# EAGLE schematic v.0.0.0 (EAGLE 5.11)

## Sheet 1 of 7
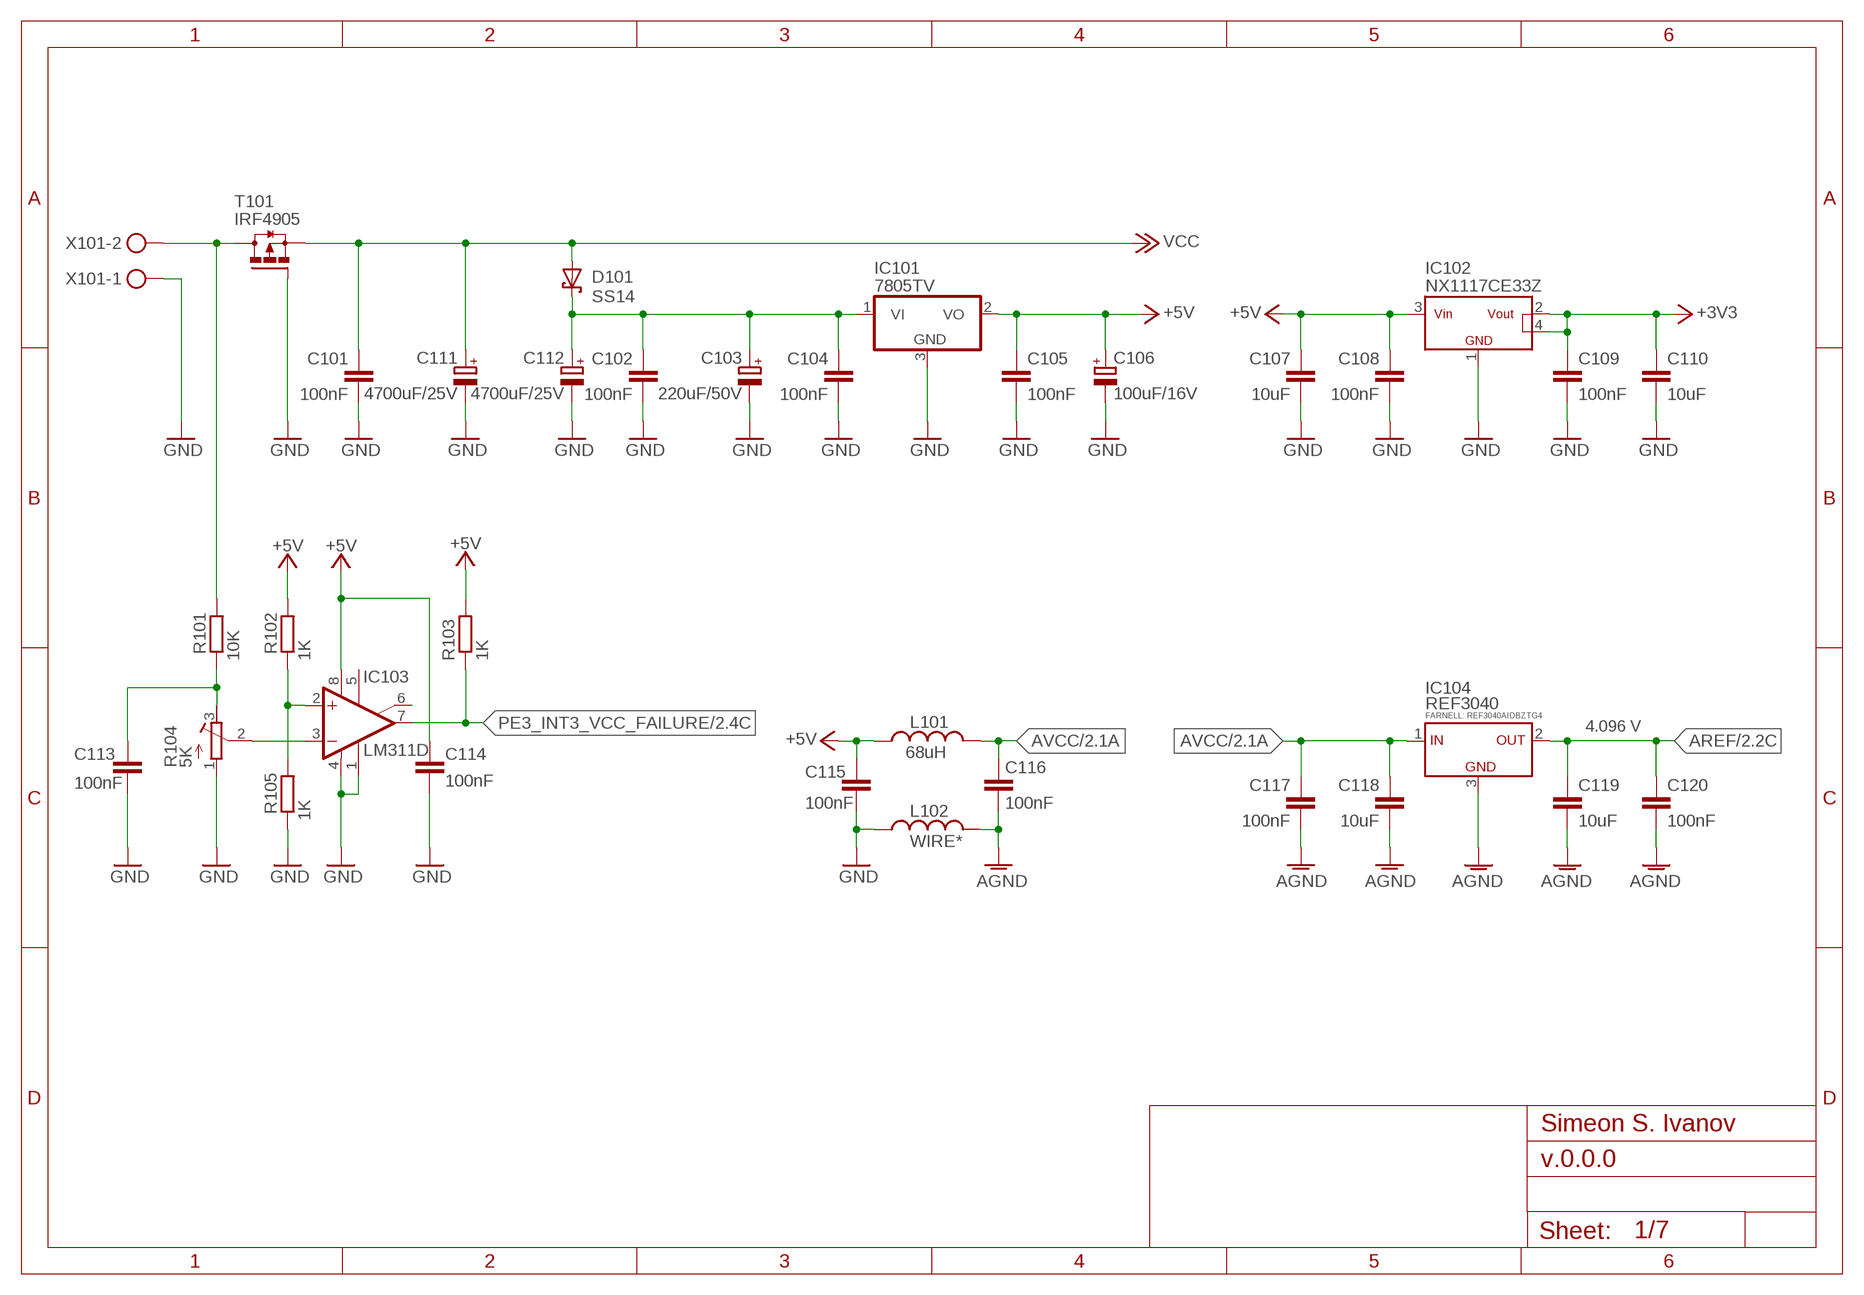
[diagram p0: schematic, sheet 1]

### Parts
C101  100nF  C-EUC1206  [C1206]
C102  100nF  C-EUC1206  [C1206]
C103  220uF/50V  CPOL-EU153CLV-0605  [153CLV-0605]
C104  100nF  C-EUC1206  [C1206]
C105  100nF  C-EUC1206  [C1206]
C106  100uF/16V  CPOL-EU153CLV-0605  [153CLV-0605]
C107  10uF  C-EUC0805  [C0805]
C108  100nF  C-EUC0603  [C0603]
C109  100nF  C-EUC0603  [C0603]
C110  10uF  C-EUC0805  [C0805]
C111  4700uF/25V  CPOL-EU_Ø500  [CP300X100X24]
C112  4700uF/25V  CPOL-EU_Ø500  [CP300X100X24]
C113  100nF  C-EUC1206  [C1206]
C114  100nF  C-EUC1206  [C1206]
C115  100nF  C-EUC1206  [C1206]
C116  100nF  C-EUC1206  [C1206]
C117  100nF  C-EUC0603  [C0603]
C118  10uF  C-EUC0805  [C0805]
C119  10uF  C-EUC0805  [C0805]
C120  100nF  C-EUC0603  [C0603]
D101  SS14  1N581SMD  [DO214AC]
IC101  7805TV  7805DT  [TO252]
IC102  NX1117CE33Z  LM317_SOT223  [SOT223]
IC103  LM311D  [SO08]
IC104  REF3040  REF33XX  [SOT23]
L101  68uH  L-US0207/2V  [0207/2V@1]
L102  WIRE*  L-US0207/2V  [0207/2V@1]
R101  10K  R-EU_R1206  [R1206]
R102  1K  R-EU_R1206  [R1206]
R103  1K  R-EU_R1206  [R1206]
R104  5K  R-TRIMM64W  [RTRIM64W]
R105  1K  R-EU_R1206  [R1206]
T101  IRF4905  PMOSFET_PTO220  [TO220]
X101  AK500/21  [AWG/2-H]

### Nets
+3V3: C109.1 C110.1 IC102.2 IC102.4(TAB) ; also sheet 6
+5V: C105.1 C106.+ C107.1 C108.1 C114.2 C115.1 IC101.2(VO) IC102.3 IC103.8(V+) L101.1 R102.2 R103.2 ; also sheet 2,4,5,7
AGND: C116.2 C117.2 C118.2 C119.2 C120.2 IC104.3 L102.2 ; also sheet 2
AREF: C119.1 C120.1 IC104.2 ; also sheet 2
AVCC: C116.1 C117.1 C118.1 IC104.1 L101.2 ; also sheet 2
GND: C101.2 C102.2 C103.- C104.2 C105.2 C106.- C107.2 C108.2 C109.2 C110.2 C111.-(-1) C112.-(-1) C113.2 C114.1 C115.2 IC101.3(GND) IC102.1 IC103.1(GND) IC103.4(V-) L102.1 R104.1(E) R105.1 T101.1(G) X101.1 ; also sheet 2,3,4,5,6,7
N$2: R101.2 T101.2(D) X101.2
N$44: C102.1 C103.+ C104.1 C112.+(+1) D101.C IC101.1(VI)
N$66: IC103.3(-IN) R104.2(S)
N$72: C113.1 R101.1 R104.3(A)
N$81: IC103.2(+IN) R102.1 R105.2
PE3_INT3_VCC_FAILURE: IC103.7(OUT) R103.1 ; also sheet 2
VCC: C101.1 C111.+(+1) D101.A T101.3(S) ; also sheet 3
Unconnected: IC103.5(ON) IC103.6(ON/STR)

### Notes on the sheet
- FARNELL: REF3040AIDBZTG4
- 4.096 V
- Simeon S. Ivanov

## Sheet 2 of 7
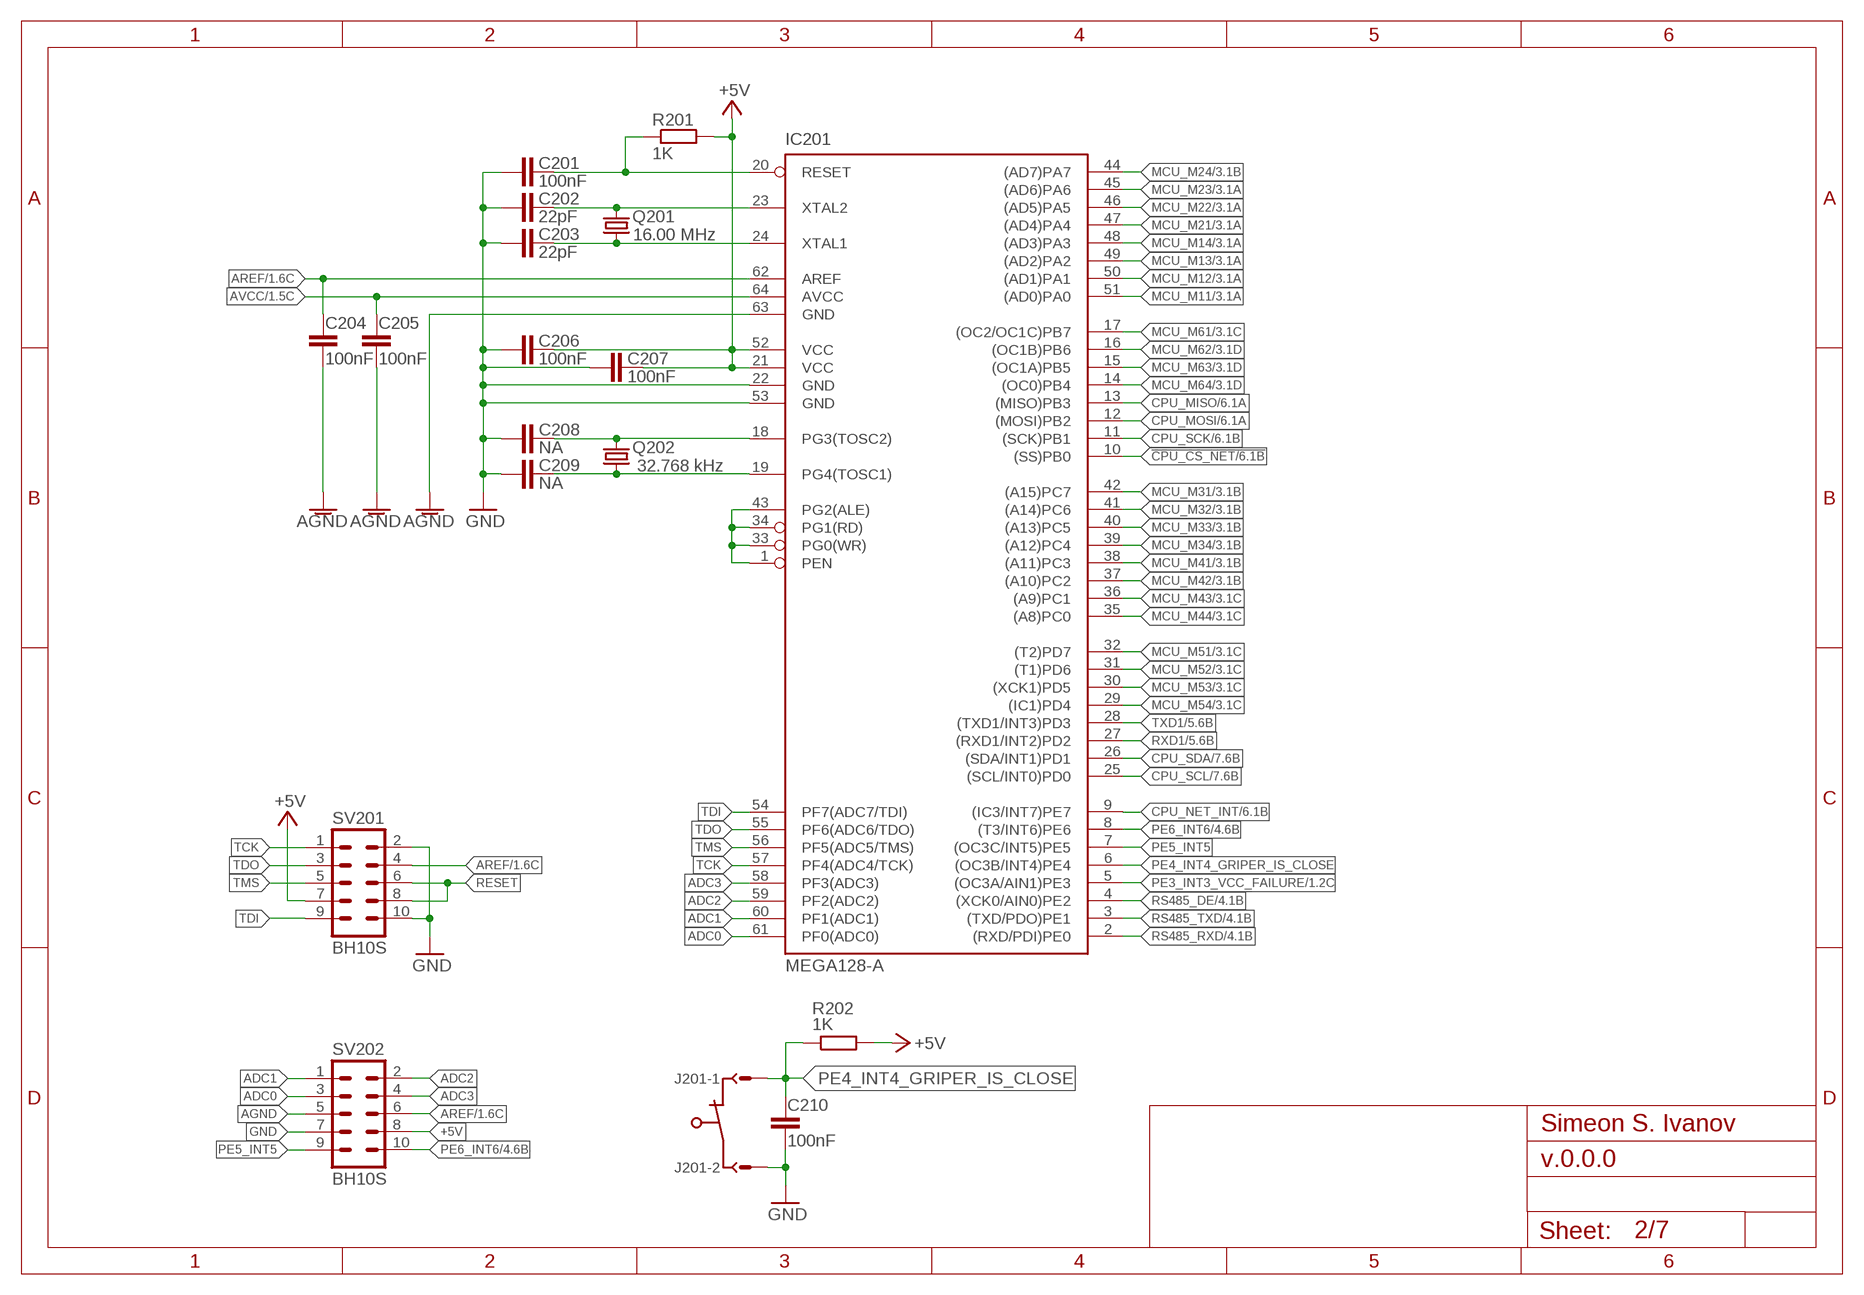
[diagram p1: schematic, sheet 2]

### Parts
C201  100nF  C-EUC1206  [C1206]
C202  22pF  C-EUC0805  [C0805]
C203  22pF  C-EUC0805  [C0805]
C204  100nF  C-EUC0603  [C0603]
C205  100nF  C-EUC0603  [C0603]
C206  100nF  C-EUC0805  [C0805]
C207  100nF  C-EUC0603  [C0603]
C208  NA  C-EUC0603  [C0603]
C209  NA  C-EUC0603  [C0603]
C210  100nF  C-EUC1206  [C1206]
IC201  MEGA128-A  MEGA128TQFP64-HOME  [TQFP64-HOME]
J201  22-27-2021-02  [6410-02]
Q201  16.00 MHz  CRYSTALHC49/S-HOME  [HC49/S-HOME]
Q202  32.768 kHz  CRYSTALTC38H  [TC38H]
R201  1K  R-EU_R1206  [R1206]
R202  1K  R-EU_R1206  [R1206]
SV201  BH10S  ML10M10-HOME  [M10-HOME]
SV202  BH10S  ML10M10-HOME  [M10-HOME]

### Nets
!CPU_CS_NET: IC201.10((SS)PB0) ; also sheet 6
+5V: C206.2 C207.2 IC201.21(VCC) IC201.52(VCC) R201.2 R202.2 SV201.7 SV202.8 ; also sheet 1,4,5,7
ADC0: IC201.61(PF0(ADC0)) SV202.3
ADC1: IC201.60(PF1(ADC1)) SV202.1
ADC2: IC201.59(PF2(ADC2)) SV202.2
ADC3: IC201.58(PF3(ADC3)) SV202.4
AGND: C204.1 C205.1 IC201.63(GND) SV202.5 ; also sheet 1
AREF: C204.2 IC201.62(AREF) SV201.4 SV202.6 ; also sheet 1
AVCC: C205.2 IC201.64(AVCC) ; also sheet 1
CPU_MISO: IC201.13((MISO)PB3) ; also sheet 6
CPU_MOSI: IC201.12((MOSI)PB2) ; also sheet 6
CPU_NET_INT: IC201.9((IC3/INT7)PE7) ; also sheet 6
CPU_SCK: IC201.11((SCK)PB1) ; also sheet 6
CPU_SCL: IC201.25((SCL/INT0)PD0) ; also sheet 7
CPU_SDA: IC201.26((SDA/INT1)PD1) ; also sheet 7
GND: C201.1 C202.1 C203.1 C206.1 C207.1 C208.1 C209.1 C210.1 IC201.22(GND) IC201.53(GND) J201.2 SV201.2 SV201.10 SV202.7 ; also sheet 1,3,4,5,6,7
MCU_M11: IC201.51((AD0)PA0) ; also sheet 3
MCU_M12: IC201.50((AD1)PA1) ; also sheet 3
MCU_M13: IC201.49((AD2)PA2) ; also sheet 3
MCU_M14: IC201.48((AD3)PA3) ; also sheet 3
MCU_M21: IC201.47((AD4)PA4) ; also sheet 3
MCU_M22: IC201.46((AD5)PA5) ; also sheet 3
MCU_M23: IC201.45((AD6)PA6) ; also sheet 3
MCU_M24: IC201.44((AD7)PA7) ; also sheet 3
MCU_M31: IC201.42((A15)PC7) ; also sheet 3
MCU_M32: IC201.41((A14)PC6) ; also sheet 3
MCU_M33: IC201.40((A13)PC5) ; also sheet 3
MCU_M34: IC201.39((A12)PC4) ; also sheet 3
MCU_M41: IC201.38((A11)PC3) ; also sheet 3
MCU_M42: IC201.37((A10)PC2) ; also sheet 3
MCU_M43: IC201.36((A9)PC1) ; also sheet 3
MCU_M44: IC201.35((A8)PC0) ; also sheet 3
MCU_M51: IC201.32((T2)PD7) ; also sheet 3
MCU_M52: IC201.31((T1)PD6) ; also sheet 3
MCU_M53: IC201.30((XCK1)PD5) ; also sheet 3
MCU_M54: IC201.29((IC1)PD4) ; also sheet 3
MCU_M61: IC201.17((OC2/OC1C)PB7) ; also sheet 3
MCU_M62: IC201.16((OC1B)PB6) ; also sheet 3
MCU_M63: IC201.15((OC1A)PB5) ; also sheet 3
MCU_M64: IC201.14((OC0)PB4) ; also sheet 3
N$10: C209.2 IC201.19(PG4(TOSC1)) Q202.1
N$11: C208.2 IC201.18(PG3(TOSC2)) Q202.2
N$60: C202.2 IC201.23(XTAL2) Q201.2
N$61: C203.2 IC201.24(XTAL1) Q201.1
NA_WIRE_0: IC201.1(PEN) IC201.33(PG0(WR)) IC201.34(PG1(RD)) IC201.43(PG2(ALE))
PE3_INT3_VCC_FAILURE: IC201.5((OC3A/AIN1)PE3) ; also sheet 1
PE4_INT4_GRIPER_IS_CLOSE: C210.2 IC201.6((OC3B/INT4)PE4) J201.1 R202.1
PE5_INT5: IC201.7((OC3C/INT5)PE5) SV202.9
PE6_INT6: IC201.8((T3/INT6)PE6) SV202.10 ; also sheet 4
RESET: C201.2 IC201.20(RESET) R201.1 SV201.6 SV201.8
RS485_DE: IC201.4((XCK0/AIN0)PE2) ; also sheet 4
RS485_RXD: IC201.2((RXD/PDI)PE0) ; also sheet 4
RS485_TXD: IC201.3((TXD/PDO)PE1) ; also sheet 4
RXD1: IC201.27((RXD1/INT2)PD2) ; also sheet 5
TCK: IC201.57(PF4(ADC4/TCK)) SV201.1
TDI: IC201.54(PF7(ADC7/TDI)) SV201.9
TDO: IC201.55(PF6(ADC6/TDO)) SV201.3
TMS: IC201.56(PF5(ADC5/TMS)) SV201.5
TXD1: IC201.28((TXD1/INT3)PD3) ; also sheet 5

### Notes on the sheet
- Simeon S. Ivanov

## Sheet 3 of 7
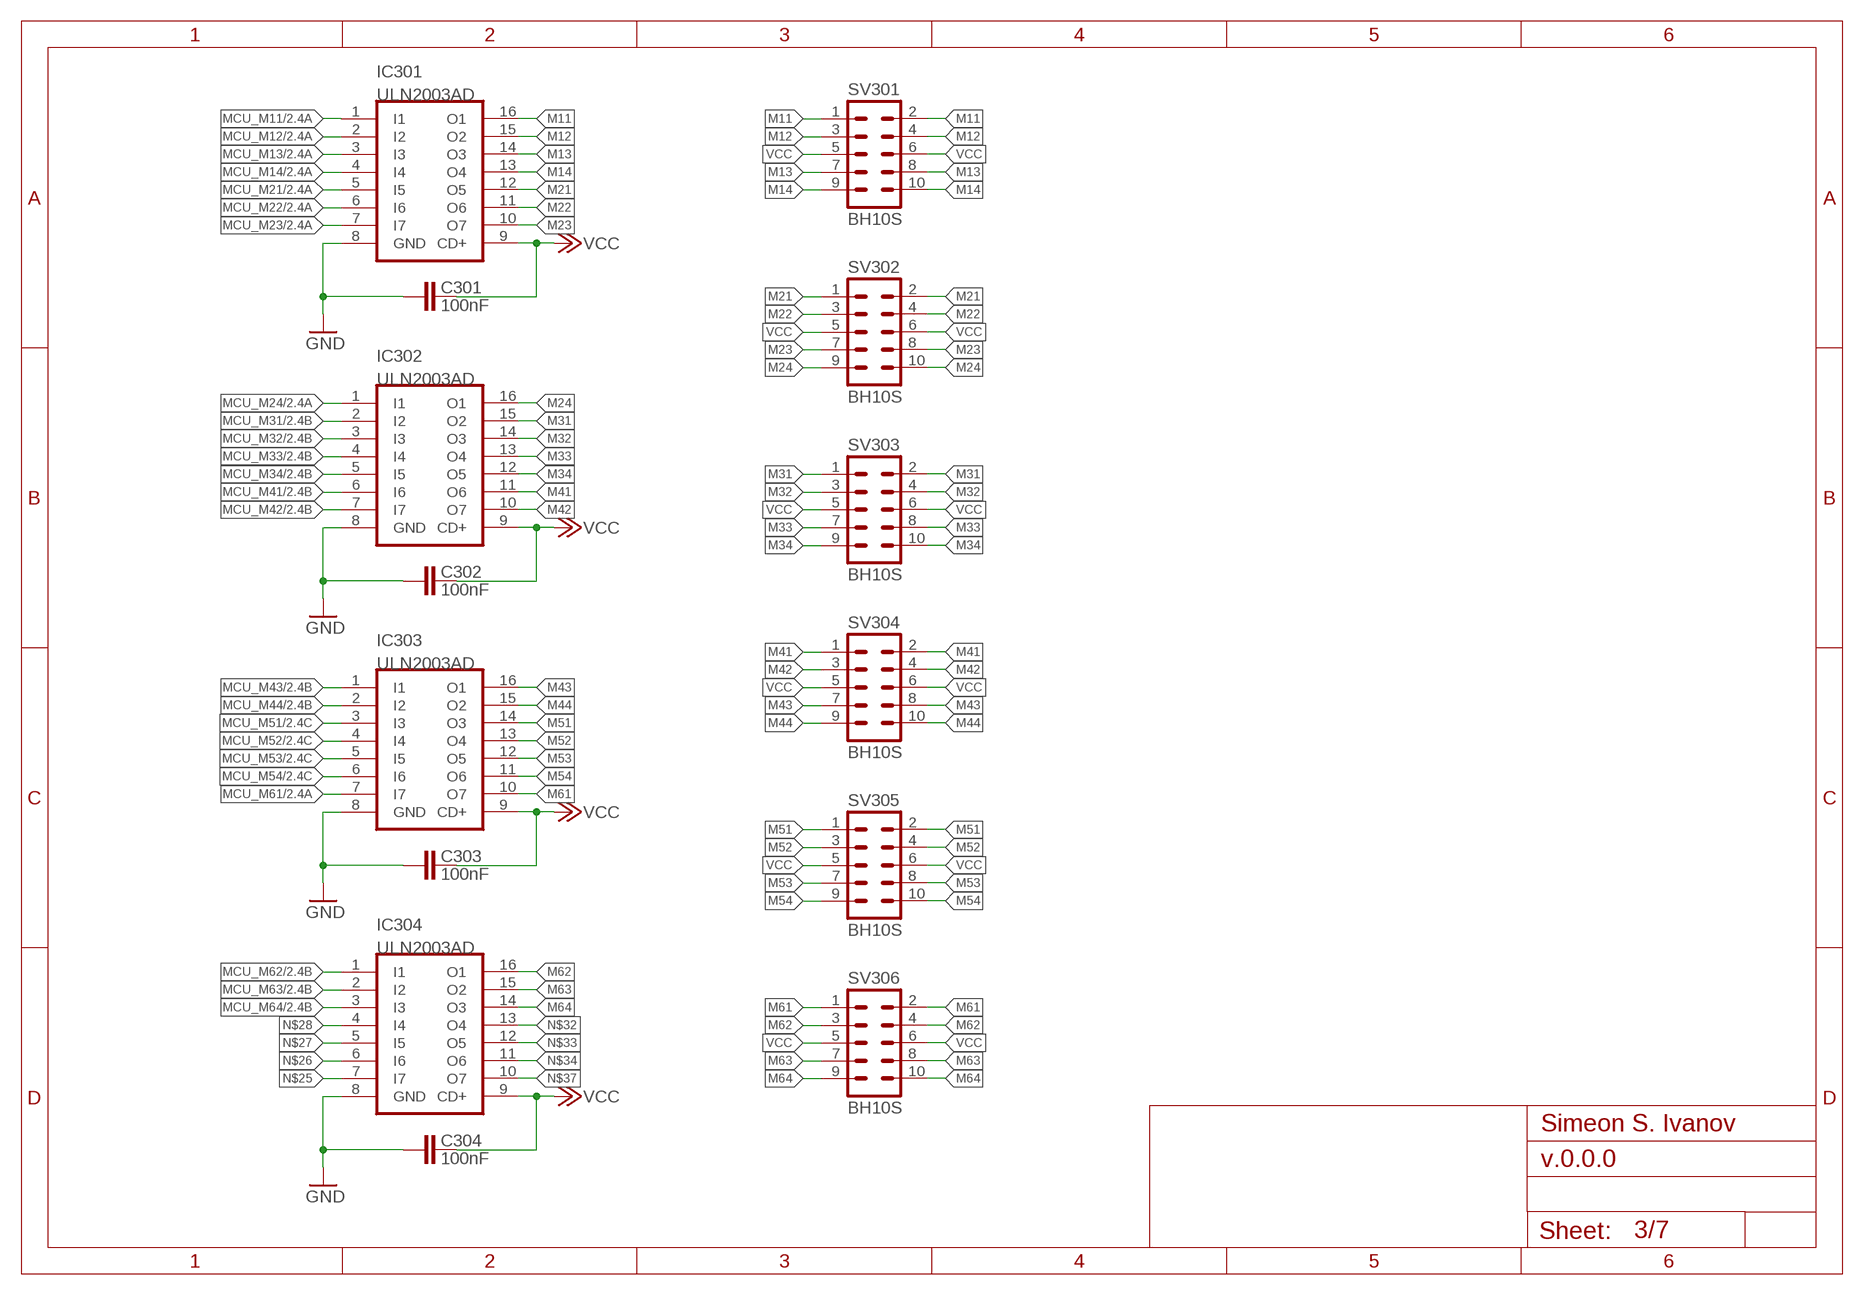
[diagram p2: schematic, sheet 3]

### Parts
C301  100nF  C-EUC1206  [C1206]
C302  100nF  C-EUC1206  [C1206]
C303  100nF  C-EUC1206  [C1206]
C304  100nF  C-EUC1206  [C1206]
IC301  ULN2003AD  [SO16]
IC302  ULN2003AD  [SO16]
IC303  ULN2003AD  [SO16]
IC304  ULN2003AD  [SO16]
SV301  BH10S  ML10M10-HOME  [M10-HOME]
SV302  BH10S  ML10M10-HOME  [M10-HOME]
SV303  BH10S  ML10M10-HOME  [M10-HOME]
SV304  BH10S  ML10M10-HOME  [M10-HOME]
SV305  BH10S  ML10M10-HOME  [M10-HOME]
SV306  BH10S  ML10M10-HOME  [M10-HOME]

### Nets
GND: C301.2 C302.2 C303.2 C304.2 IC301.8(GND) IC302.8(GND) IC303.8(GND) IC304.8(GND) ; also sheet 1,2,4,5,6,7
M11: IC301.16(O1) SV301.1 SV301.2
M12: IC301.15(O2) SV301.3 SV301.4
M13: IC301.14(O3) SV301.7 SV301.8
M14: IC301.13(O4) SV301.9 SV301.10
M21: IC301.12(O5) SV302.1 SV302.2
M22: IC301.11(O6) SV302.3 SV302.4
M23: IC301.10(O7) SV302.7 SV302.8
M24: IC302.16(O1) SV302.9 SV302.10
M31: IC302.15(O2) SV303.1 SV303.2
M32: IC302.14(O3) SV303.3 SV303.4
M33: IC302.13(O4) SV303.7 SV303.8
M34: IC302.12(O5) SV303.9 SV303.10
M41: IC302.11(O6) SV304.1 SV304.2
M42: IC302.10(O7) SV304.3 SV304.4
M43: IC303.16(O1) SV304.7 SV304.8
M44: IC303.15(O2) SV304.9 SV304.10
M51: IC303.14(O3) SV305.1 SV305.2
M52: IC303.13(O4) SV305.3 SV305.4
M53: IC303.12(O5) SV305.7 SV305.8
M54: IC303.11(O6) SV305.9 SV305.10
M61: IC303.10(O7) SV306.1 SV306.2
M62: IC304.16(O1) SV306.3 SV306.4
M63: IC304.15(O2) SV306.7 SV306.8
M64: IC304.14(O3) SV306.9 SV306.10
MCU_M11: IC301.1(I1) ; also sheet 2
MCU_M12: IC301.2(I2) ; also sheet 2
MCU_M13: IC301.3(I3) ; also sheet 2
MCU_M14: IC301.4(I4) ; also sheet 2
MCU_M21: IC301.5(I5) ; also sheet 2
MCU_M22: IC301.6(I6) ; also sheet 2
MCU_M23: IC301.7(I7) ; also sheet 2
MCU_M24: IC302.1(I1) ; also sheet 2
MCU_M31: IC302.2(I2) ; also sheet 2
MCU_M32: IC302.3(I3) ; also sheet 2
MCU_M33: IC302.4(I4) ; also sheet 2
MCU_M34: IC302.5(I5) ; also sheet 2
MCU_M41: IC302.6(I6) ; also sheet 2
MCU_M42: IC302.7(I7) ; also sheet 2
MCU_M43: IC303.1(I1) ; also sheet 2
MCU_M44: IC303.2(I2) ; also sheet 2
MCU_M51: IC303.3(I3) ; also sheet 2
MCU_M52: IC303.4(I4) ; also sheet 2
MCU_M53: IC303.5(I5) ; also sheet 2
MCU_M54: IC303.6(I6) ; also sheet 2
MCU_M61: IC303.7(I7) ; also sheet 2
MCU_M62: IC304.1(I1) ; also sheet 2
MCU_M63: IC304.2(I2) ; also sheet 2
MCU_M64: IC304.3(I3) ; also sheet 2
N$25: IC304.7(I7)
N$26: IC304.6(I6)
N$27: IC304.5(I5)
N$28: IC304.4(I4)
N$32: IC304.13(O4)
N$33: IC304.12(O5)
N$34: IC304.11(O6)
N$37: IC304.10(O7)
VCC: C301.1 C302.1 C303.1 C304.1 IC301.9(CD+) IC302.9(CD+) IC303.9(CD+) IC304.9(CD+) SV301.5 SV301.6 SV302.5 SV302.6 SV303.5 SV303.6 SV304.5 SV304.6 SV305.5 SV305.6 SV306.5 SV306.6 ; also sheet 1

### Notes on the sheet
- Simeon S. Ivanov

## Sheet 4 of 7
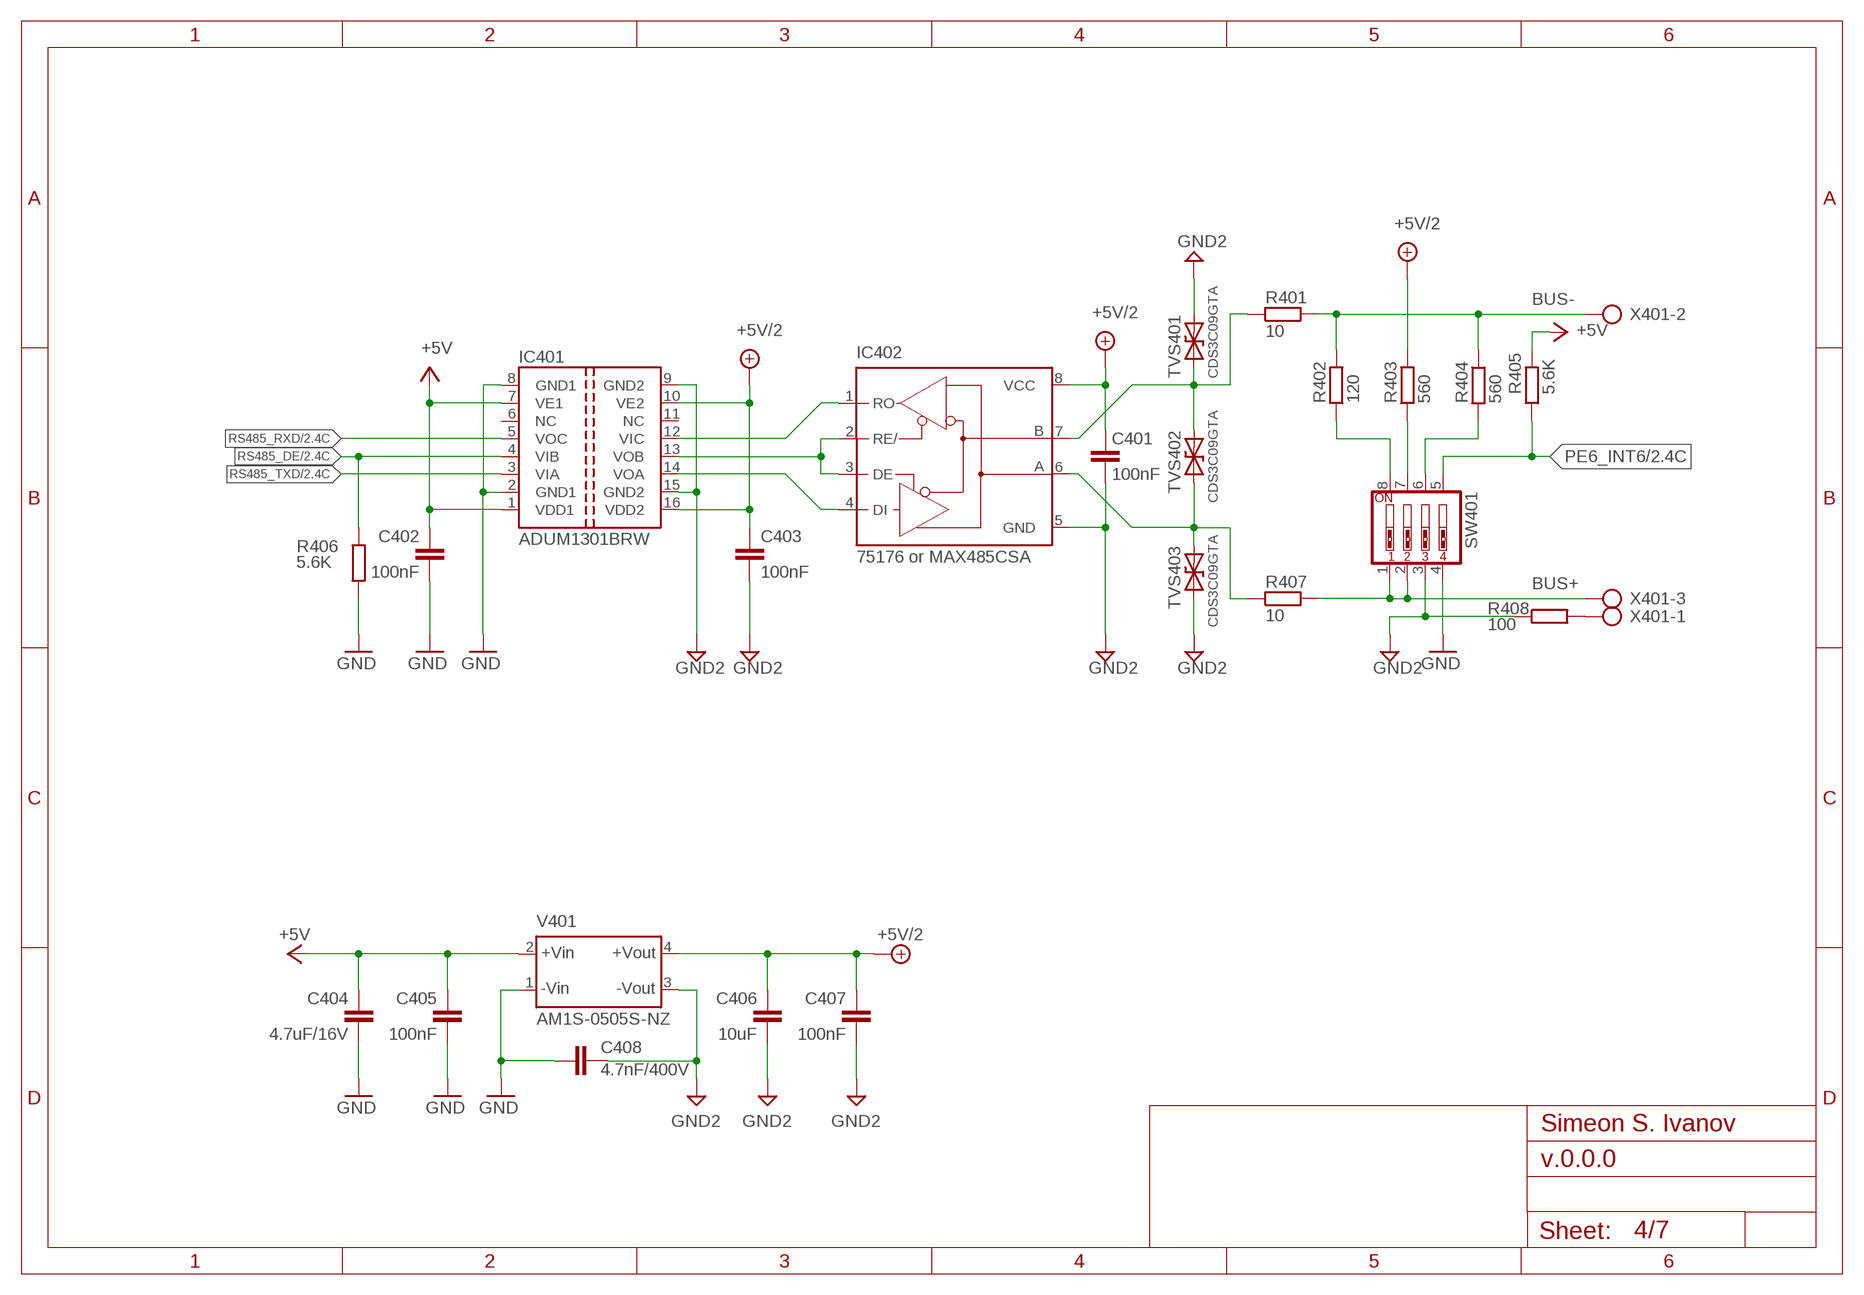
[diagram p3: schematic, sheet 4]

### Parts
C401  100nF  C-EUC1206  [C1206]
C402  100nF  C-EUC0603  [C0603]
C403  100nF  C-EUC0603  [C0603]
C404  4.7uF/16V  C-EUC0805  [C0805]
C405  100nF  C-EUC0603  [C0603]
C406  10uF  C-EUC0805  [C0805]
C407  100nF  C-EUC0603  [C0603]
C408  4.7nF/400V  C-EU050-025X075  [C050-025X075]
IC401  ADUM1301BRW  [SO-16W]
IC402  75176 or MAX485CSA  MAX3468CSA  [SO08]
R401  10  R-EU_R1206  [R1206]
R402  120  R-EU_R1206  [R1206]
R403  560  R-EU_R1206  [R1206]
R404  560  R-EU_R1206  [R1206]
R405  5.6K  R-EU_R0603  [R0603]
R406  5.6K  R-EU_R0603  [R0603]
R407  10  R-EU_R1206  [R1206]
R408  100  R-EU_R1206  [R1206]
SW401  SW_DIP-4  [EDG-04]
TVS401  CDS3C09GTA  B72500DD06063  [D0603]
TVS402  CDS3C09GTA  B72500DD06063  [D0603]
TVS403  CDS3C09GTA  B72500DD06063  [D0603]
V401  AM1S-0505S-NZ  TME1205S  [TME]
X401  AK500/31  [AWG/3-H]

### Nets
+5V: C402.1 C404.1 C405.1 IC401.1(VDD1) IC401.7(VE1) R405.2 V401.2(+VIN) ; also sheet 1,2,5,7
+5V/2: C401.2 C403.1 C406.1 C407.1 IC401.10(VE2) IC401.16(VDD2) IC402.8(VCC) R403.2 V401.4(+VOUT)
BUS+: R407.2 SW401.1 SW401.2 X401.3
BUS-: R401.2 R402.2 R404.1 X401.2
GND: C402.2 C404.2 C405.2 C408.1 IC401.2(GND1) IC401.8(GND1) R406.1 SW401.4 V401.1(-VIN) ; also sheet 1,2,3,5,6,7
GND2: C401.1 C403.2 C406.2 C407.2 C408.2 IC401.9(GND2) IC401.15(GND2) IC402.5(GND) R408.1 SW401.3 TVS401.2 TVS403.1 V401.3(-VOUT)
N$4: IC401.13(VOB) IC402.2(RE/) IC402.3(DE)
N$40: IC402.7(B) R401.1 TVS401.1 TVS402.2
N$42: R408.2 X401.1
N$58: IC401.14(VOA) IC402.4(DI)
N$77: IC401.12(VIC) IC402.1(RO)
N$93: IC402.6(A) R407.1 TVS402.1 TVS403.2
N$112: R403.1 SW401.7
N$129: R404.2 SW401.6
N$140: R402.1 SW401.8
PE6_INT6: R405.1 SW401.5 ; also sheet 2
RS485_DE: IC401.4(VIB) R406.2 ; also sheet 2
RS485_RXD: IC401.5(VOC) ; also sheet 2
RS485_TXD: IC401.3(VIA) ; also sheet 2
Unconnected: IC401.6(NC) IC401.11(NC)

### Notes on the sheet
- Simeon S. Ivanov

## Sheet 5 of 7
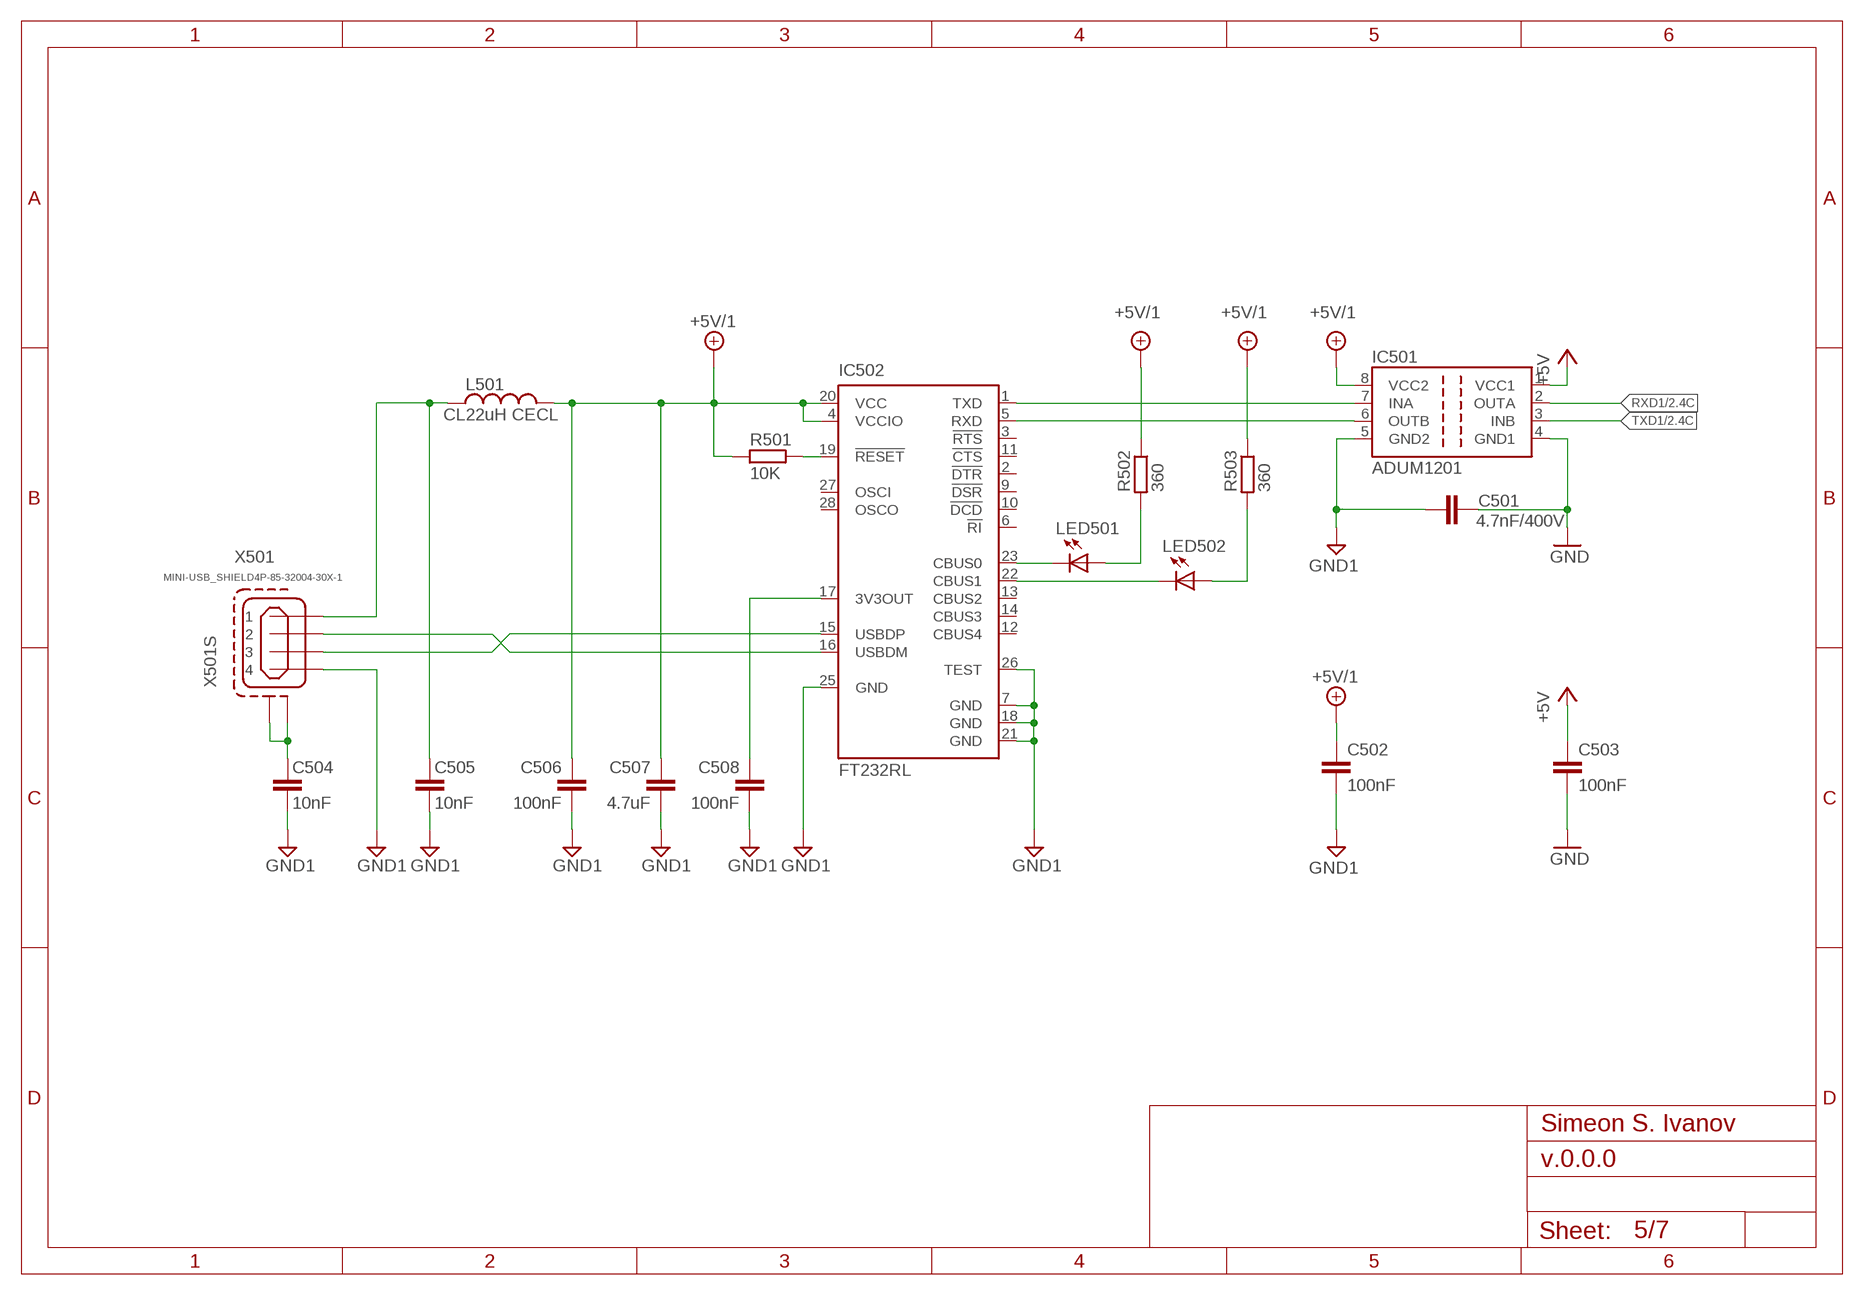
[diagram p4: schematic, sheet 5]

### Parts
C501  4.7nF/400V  C-EU050-025X075  [C050-025X075]
C502  100nF  C-EUC1206  [C1206]
C503  100nF  C-EUC1206  [C1206]
C504  10nF  C-EUC1206  [C1206]
C505  10nF  C-EUC1206  [C1206]
C506  100nF  C-EUC1206  [C1206]
C507  4.7uF  C-EUC1206  [C1206]
C508  100nF  C-EUC1206  [C1206]
IC501  ADUM1201  ADUM1201SO08  [SO8]
IC502  FT232RL  [SSOP28]
L501  CL22uH CECL  L-US0207/2V  [0207/2V@1]
LED501  LEDLED3MM-HOME  [LED3MM-HOME]
LED502  LEDLED3MM-HOME  [LED3MM-HOME]
R501  10K  R-EU_R1206  [R1206]
R502  360  R-EU_R1206  [R1206]
R503  360  R-EU_R1206  [R1206]
X501  MINI-USB_SHIELD4P-85-32004-30X-1  MINI-USB_SHIELD4P-85-32004-00X  [85-32004-00X]

### Nets
+5V: C503.1 IC501.1(VCC1) ; also sheet 1,2,4,7
+5V/1: C502.1 C506.1 C507.1 IC501.8(VCC2) IC502.4(VCCIO) IC502.20(VCC) L501.2 R501.1 R502.1 R503.1
GND: C501.1 C503.2 IC501.4(GND1) ; also sheet 1,2,3,4,6,7
GND1: C501.2 C502.2 C504.2 C505.2 C506.2 C507.2 C508.2 IC501.5(GND2) IC502.7(GND) IC502.18(GND) IC502.21(GND) IC502.25(GND) IC502.26(TEST) X501.4
N$64: IC502.23(CBUS0) LED501.K(C)
N$65: IC502.22(CBUS1) LED502.K(C)
N$67: LED501.A R502.2
N$68: LED502.A R503.2
N$69: C504.1 X501.M1(S1) X501.M2(S2)
N$70: IC501.7(INA) IC502.1(TXD)
N$71: IC501.6(OUTB) IC502.5(RXD)
N$78: IC502.16(USBDM) X501.2
N$79: IC502.15(USBDP) X501.3
N$100: IC502.19(!RESET) R501.2
N$127: C508.1 IC502.17(3V3OUT)
RXD1: IC501.2(OUTA) ; also sheet 2
TXD1: IC501.3(INB) ; also sheet 2
USB_5V: C505.1 L501.1 X501.1
Unconnected: IC502.2(!DTR) IC502.3(!RTS) IC502.6(!RI) IC502.9(!DSR) IC502.10(!DCD) IC502.11(!CTS) IC502.12(CBUS4) IC502.13(CBUS2) IC502.14(CBUS3) IC502.27(OSCI) IC502.28(OSCO)

### Notes on the sheet
- Simeon S. Ivanov

## Sheet 6 of 7
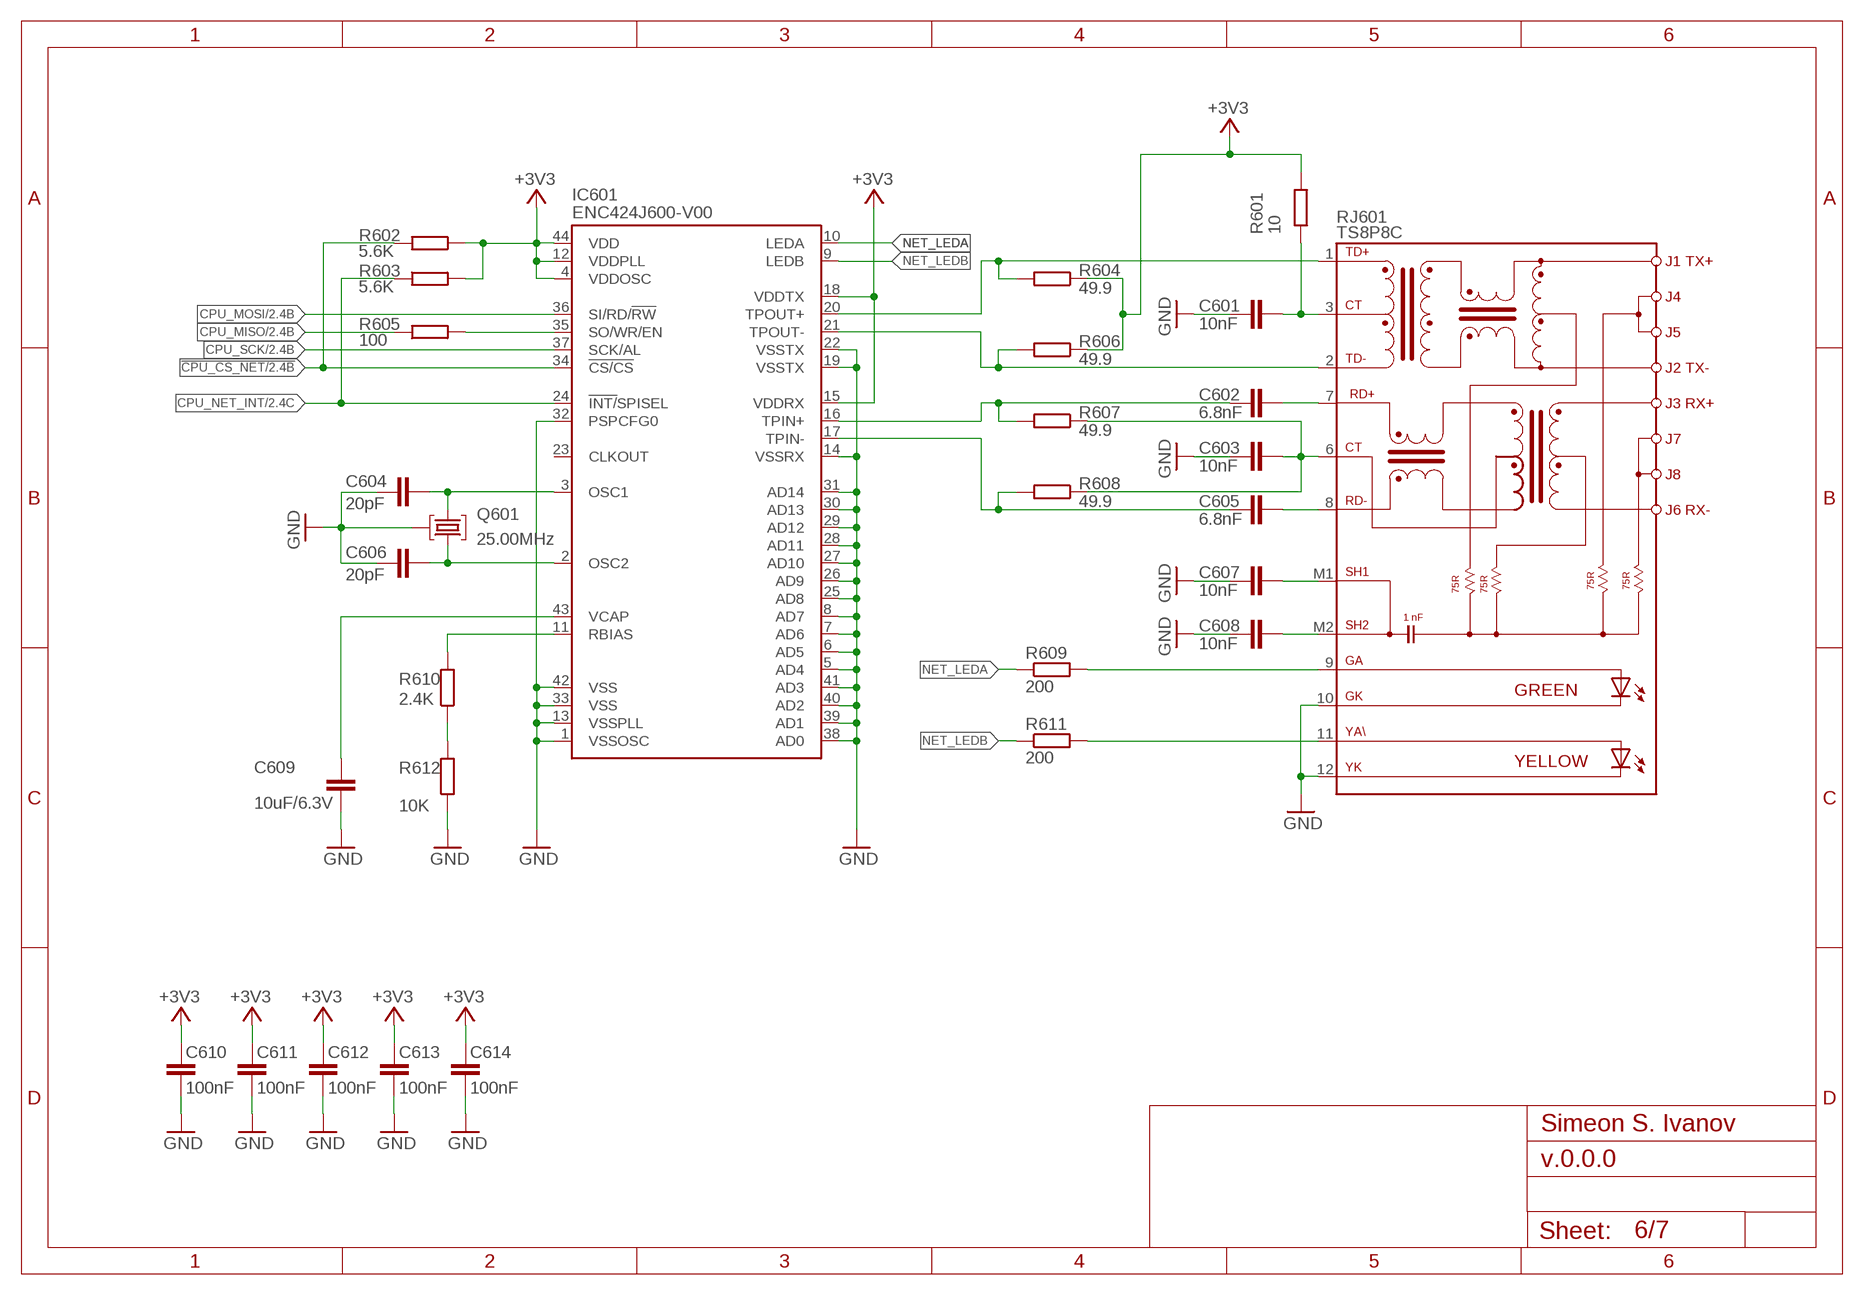
[diagram p5: schematic, sheet 6]

### Parts
C601  10nF  C-EUC0603  [C0603]
C602  6.8nF  C-EUC0603  [C0603]
C603  10nF  C-EUC0603  [C0603]
C604  20pF  C-EUC0603  [C0603]
C605  6.8nF  C-EUC0603  [C0603]
C606  20pF  C-EUC0603  [C0603]
C607  10nF  C-EUC0603  [C0603]
C608  10nF  C-EUC0603  [C0603]
C609  10uF/6.3V  C-EUC0805  [C0805]
C610  100nF  C-EUC0603  [C0603]
C611  100nF  C-EUC0603  [C0603]
C612  100nF  C-EUC0603  [C0603]
C613  100nF  C-EUC0603  [C0603]
C614  100nF  C-EUC0603  [C0603]
IC601  ENC424J600-V00  [TQFP44]
Q601  25.00MHz  ECS-10.7-7.5A  [HC49U]
R601  10  R-EU_R0603  [R0603]
R602  5.6K  R-EU_R0603  [R0603]
R603  5.6K  R-EU_R0603  [R0603]
R604  49.9  R-EU_R0603  [R0603]
R605  100  R-EU_R0603  [R0603]
R606  49.9  R-EU_R0603  [R0603]
R607  49.9  R-EU_R0603  [R0603]
R608  49.9  R-EU_R0603  [R0603]
R609  200  R-EU_R1206  [R1206]
R610  2.4K  R-EU_R0603  [R0603]
R611  200  R-EU_R1206  [R1206]
R612  10K  R-EU_R0603  [R0603]
RJ601  TS8P8C  [TS8P8C]

### Nets
!CPU_CS_NET: IC601.34(!CS/CS) R602.2 ; also sheet 2
+3V3: C610.2 C611.2 C612.2 C613.2 C614.2 IC601.4(VDDOSC) IC601.12(VDDPLL) IC601.15(VDDRX) IC601.18(VDDTX) IC601.44(VDD) R601.1 R602.1 R603.2 R604.1 R606.1 ; also sheet 1
CPU_MISO: R605.1 ; also sheet 2
CPU_MOSI: IC601.36(SI/RD/!RW) ; also sheet 2
CPU_NET_INT: IC601.24(!INT/!SPISEL) R603.1 ; also sheet 2
CPU_SCK: IC601.37(SCK/AL) ; also sheet 2
GND: C601.1 C603.1 C604.1 C606.1 C607.1 C608.1 C609.1 C610.1 C611.1 C612.1 C613.1 C614.1 IC601.1(VSSOSC) IC601.5(AD4) IC601.6(AD5) IC601.7(AD6) IC601.8(AD7) IC601.13(VSSPLL) IC601.14(VSSRX) IC601.19(VSSTX) IC601.22(VSSTX) IC601.25(AD8) IC601.26(AD9) IC601.27(AD10) IC601.28(AD11) IC601.29(AD12) IC601.30(AD13) IC601.31(AD14) IC601.32(PSPCFG0) IC601.33(VSS) IC601.38(AD0) IC601.39(AD1) IC601.40(AD2) IC601.41(AD3) IC601.42(VSS) Q601.2 R612.1 RJ601.10(GK) RJ601.12(YK) ; also sheet 1,2,3,4,5,7
N$14: C607.2 RJ601.M1(SH1)
N$15: C608.2 RJ601.M2(SH2)
N$85: C605.2 RJ601.8(RD-)
N$88: C602.2 RJ601.7(RD+)
N$95: R611.2 RJ601.11(YA)
N$97: R609.2 RJ601.9(GA)
N$114: C604.2 IC601.3(OSC1) Q601.1
N$115: C606.2 IC601.2(OSC2) Q601.3
N$157: C609.2 IC601.43(VCAP)
N$158: IC601.11(RBIAS) R610.2
N$163: R610.1 R612.2
N$165: IC601.35(SO/WR/EN) R605.2
NET_LEDA: IC601.10(LEDA) R609.1
NET_LEDB: IC601.9(LEDB) R611.1
RD+: C602.1 IC601.16(TPIN+) R607.2
RD-: C605.1 IC601.17(TPIN-) R608.2
RD_CT: C603.2 R607.1 R608.1 RJ601.6(RDC)
TD+: IC601.20(TPOUT+) R604.2 RJ601.1(TD+)
TD-: IC601.21(TPOUT-) R606.2 RJ601.2(TD-)
TD_CT: C601.2 R601.2 RJ601.3(TDC)
Unconnected: IC601.23(CLKOUT)

### Notes on the sheet
- Simeon S. Ivanov

## Sheet 7 of 7
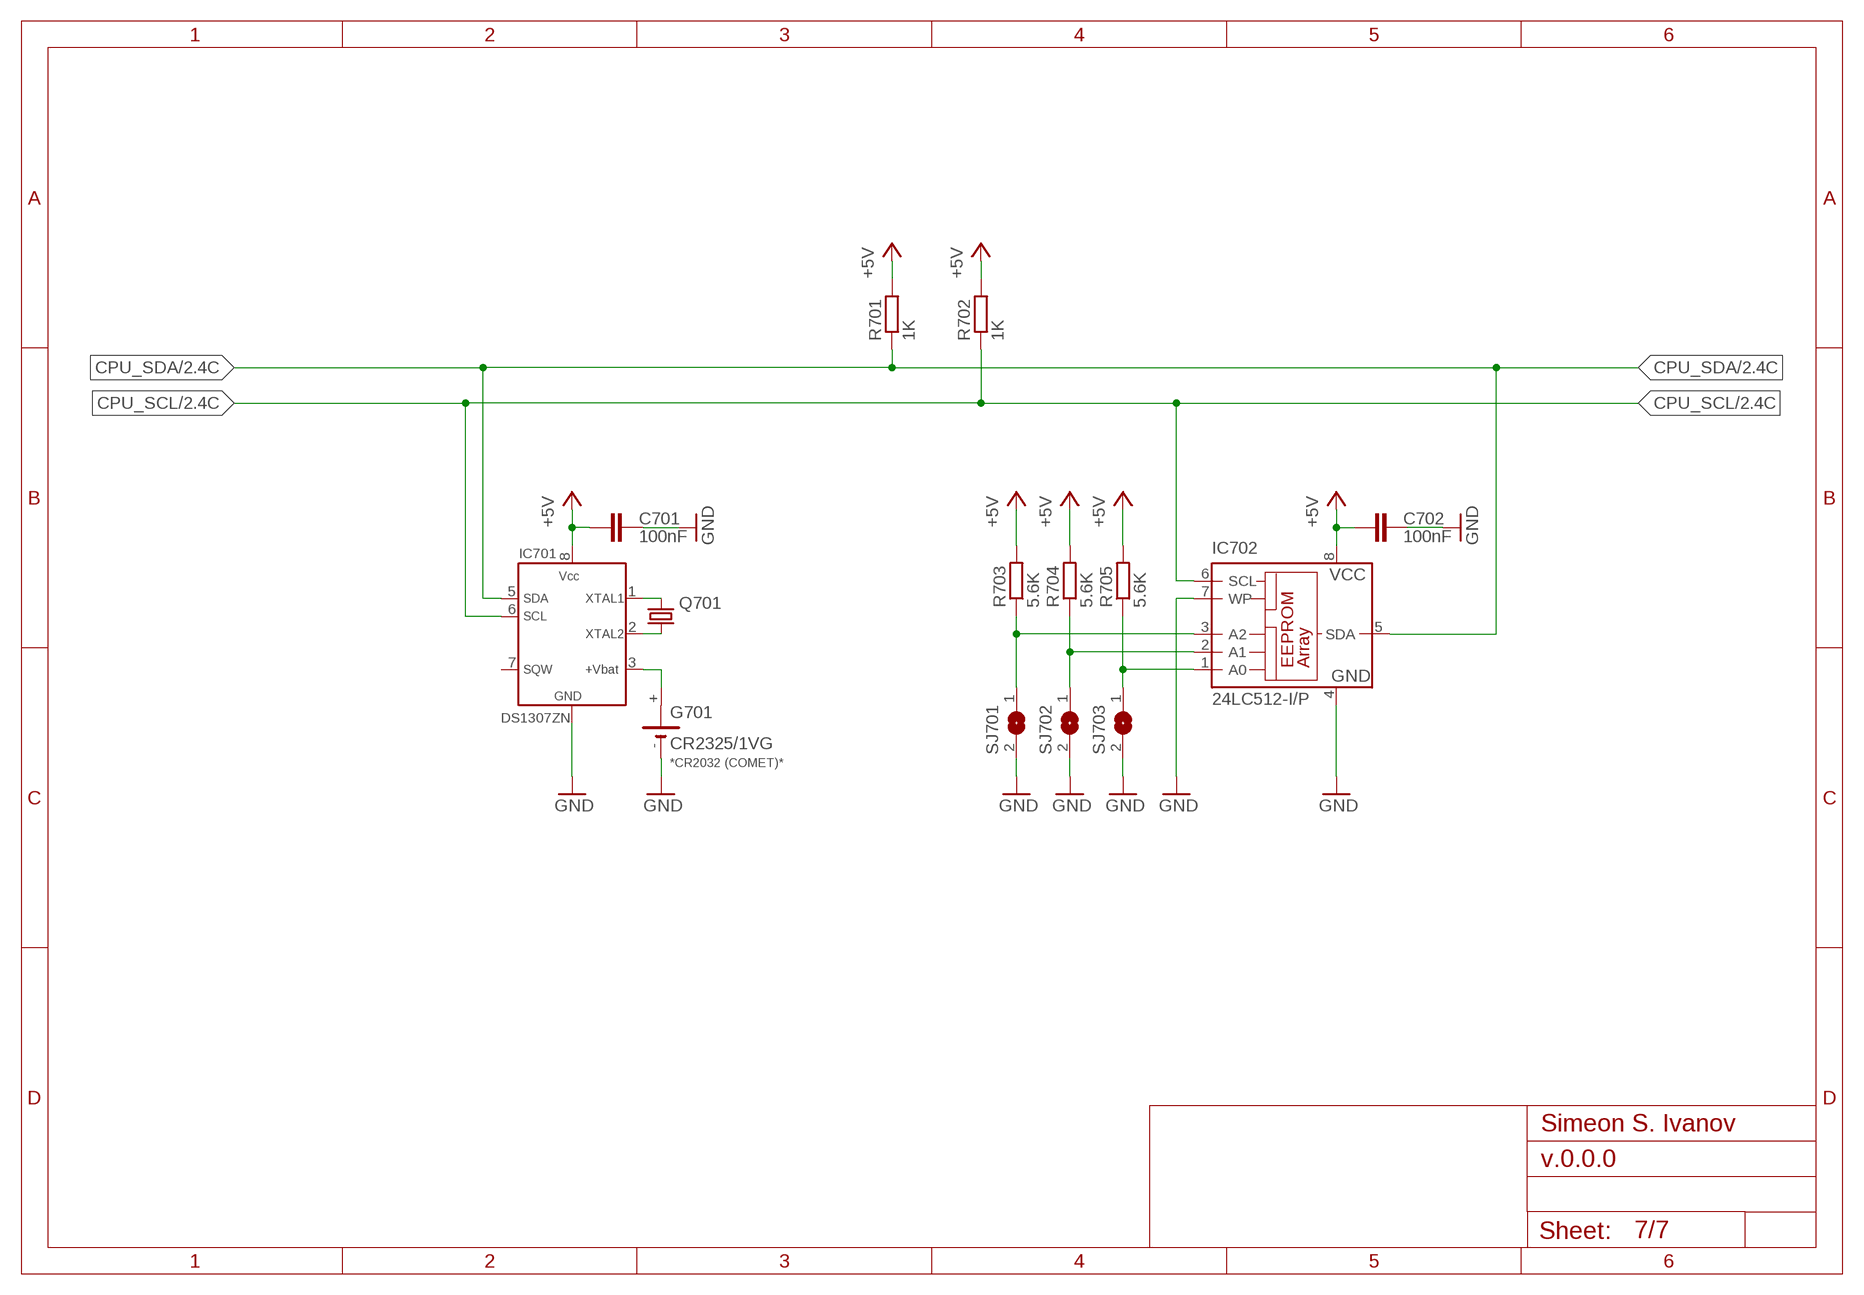
[diagram p6: schematic, sheet 7]

### Parts
C701  100nF  C-EUC0603  [C0603]
C702  100nF  C-EUC0603  [C0603]
G701  CR2325/1VG  CRXXXX0  [CR2325/1VG]
IC701  DS1307ZN  DS1307  [SO8]
IC702  24LC512-I/P  24DIL8-NEW  [DIL8-NEW]
Q701  CRYSTALTC38H  [TC38H]
R701  1K  R-EU_R0603  [R0603]
R702  1K  R-EU_R0603  [R0603]
R703  5.6K  R-EU_R0603  [R0603]
R704  5.6K  R-EU_R0603  [R0603]
R705  5.6K  R-EU_R0603  [R0603]
SJ701  SJ  [SJ]
SJ702  SJ  [SJ]
SJ703  SJ  [SJ]

### Nets
+5V: C701.2 C702.1 IC701.8 IC702.8(VCC) R701.2 R702.2 R703.2 R704.2 R705.2 ; also sheet 1,2,4,5
CPU_SCL: IC701.6 IC702.6(SCL) R702.1 ; also sheet 2
CPU_SDA: IC701.5 IC702.5(SDA) R701.1 ; also sheet 2
GND: C701.1 C702.2 G701.- IC701.4 IC702.4(GND) IC702.7(WP) SJ701.2 SJ702.2 SJ703.2 ; also sheet 1,2,3,4,5,6
N$3: IC701.1 Q701.1
N$5: IC701.2 Q701.2
N$6: G701.+ IC701.3
N$7: IC702.3(A2) R703.1 SJ701.1
N$8: IC702.2(A1) R704.1 SJ702.1
N$9: IC702.1(A0) R705.1 SJ703.1
Unconnected: G701.+@1(+) IC701.7

### Notes on the sheet
- *CR2032 (COMET)*
- Simeon S. Ivanov

## Library data of the parts
C101 C102 C104 C105 C107-C110 C113-C120 C201-C210 C301-C304 C401-C408 C501-C508 C601-C614 C701 C702 = rcl:C-EU: CAPACITOR, European symbol
C103 C106 = rcl:CPOL-EU: POLARIZED CAPACITOR, European symbol
C111 C112 = myRcl:CPOL-EU_
D101 = diode:1N581*: 1.0A SCHOTTKY BARRIER RECTIFIER Source: http://www.diodes.com/datasheets/ds23001.pdf
G701 = battery:CRXXXX: LI BATTERY Varta
IC101 = linear:78*: Positive VOLTAGE REGULATOR Source: http://cache.national.com/ds/LM/LM78L05.pdf http://www.fairchildsemi.com/ds/LM/LM7805.pdf
IC102 = linear:LM317_SOT223
IC103 = linear:LM311: COMPARATOR
IC104 = v-reg:REF33XX
IC201 = atmel:MEGA128: MICROCONTROLLER 128 Kbytes FLASH 4 Kbytes SRAM 4 Kbytes EEPROM DUAL USART 8-channel 10 bit ADC Source: avr.lbr
IC301-IC304 = uln-udn:ULN2003A: DRIVER ARRAY
IC401 = myAnalog-Devices:ADUM1301: Maximum Data Rate (Mbps): 10 -40°C to +105°C 16-Lead SOIC_W RW-16
IC402 = maxim:MAX34*: +5V, Fail-Safe, 40Mbps, Profibus RS-485/RS-422 Transceivers Source: MAX3465-MAX3469.pdf
IC501 = analog-devices:ADUM1201: DIGITAL ISOLATOR
IC502 = ftdichip:FT232R: Source: http://www.ftdichip.com/Documents/DataSheets/DS_FT232R_v104.pdf
IC601 = microchip:ENC424J600-V0
IC701 = dallas:DS1307: RTC
IC702 = microchip:24*: Serial EEPROM I2C
J201 = con-molex:22-?-02: CONNECTOR wire to board 2.54 mm (.1 inch) pitch header; OC_FARNELL: unknown; OC_NEWARK: unknown
L101 L102 L501 = rcl:L-US: INDUCTOR, American symbol
LED501 LED502 = led:LED: LED OSRAM: - CHIPLED LG R971, LG N971, LY N971, LG Q971, LY Q971, LO R971, LY R971 LH N974, LH R974 LS Q976, LO Q976, LY Q976 LO Q996 - Hyper CHIPLED LW Q18S LB Q993, LB Q99A, LB R99A - SideLED LS A670, LO A670, LY A670, LG A670, LP A670 LB A673, LV A673, LT A673, LW A673 LH A674 LY A675 LS A676, LA A676, LO A676, LY A676, LW A676 LS A679, LY A679, LG A679 - Hyper Micro SIDELED® LS Y876, LA Y876, LO Y876, LY Y876 LT Y87S - SmartLED LW L88C, LW L88S LB L89C, LB L89S, LG L890 LS L89K, LO L89K, LY L89K LS L896, LA L896, LO L896, LY L896 - TOPLED LS T670, LO T670, LY T670, LG T670, LP T670 LSG T670, LSP T670, LSY T670, LOP T670, LYG T670 LG T671, LOG T671, LSG T671 LB T673, LV T673, LT T673, LW T673 LH T674 LS T676, LA T676, LO T676, LY T676, LB T676, LH T676, LSB T676, LW T676 LB T67C, LV T67C, LT T67C, LS T67K, LO T67K, LY T67K, LW E67C LS E67B, LA E67B, LO E67B, LY E67B, LB E67C, LV E67C, LT E67C LW T67C LS T679, LY T679, LG T679 LS T770, LO T770, LY T770, LG T770, LP T770 LB T773, LV T773, LT T773, LW T773 LH T774 LS E675, LA E675, LY E675, LS T675 LS T776, LA T776, LO T776, LY T776, LB T776 LHGB T686 LT T68C, LB T68C - Hyper Mini TOPLED® LB M676 - Mini TOPLED Santana® LG M470 LS M47K, LO M47K, LY M47K Source: http://www.osram.convergy.de LUXEON: - LUMILED® LXK2-PW12-R00, LXK2-PW12-S00, LXK2-PW14-U00, LXK2-PW14-V00 LXK2-PM12-R00, LXK2-PM12-S00, LXK2-PM14-U00 LXK2-PE12-Q00, LXK2-PE12-R00, LXK2-PE12-S00, LXK2-PE14-T00, LXK2-PE14-U00 LXK2-PB12-K00, LXK2-PB12-L00, LXK2-PB12-M00, LXK2-PB14-N00, LXK2-PB14-P00, LXK2-PB14-Q00 LXK2-PR12-L00, LXK2-PR12-M00, LXK2-PR14-Q00, LXK2-PR14-R00 LXK2-PD12-Q00, LXK2-PD12-R00, LXK2-PD12-S00 LXK2-PH12-R00, LXK2-PH12-S00 LXK2-PL12-P00, LXK2-PL12-Q00, LXK2-PL12-R00 Source: www.luxeon.com KINGBRIGHT: KA-3528ASYC Source: www.kingbright.com
Q201 = crystal:CRYSTAL: CRYSTAL
Q202 Q701 = crystal:CRYSTAL: CRYSTAL; OC_FARNELL: unknown; OC_NEWARK: unknown
Q601 = crystal:ECS: MONOLITHIC CRYSTAL FILTERS Source: http://www.presto.co.uk; OC_FARNELL: unknown; OC_NEWARK: unknown
R101-R103 R105 R201 R202 R401-R408 R501-R503 R601-R612 R701-R705 = rcl:R-EU_: RESISTOR, European symbol
R104 = rcl:R-TRIMM: Trimm resistor
RJ601 = con-pulse:TS8P8C
SJ701-SJ703 = jumper:SJ: SMD solder JUMPER
SV201 SV202 SV301-SV306 = con-harting-ml:ML10: HARTING
SW401 = special:SW_DIP-4: DIP SWITCH
T101 = myTransistor-Power:PMOSFET_P
TVS401-TVS403 = diode:B72500D
V401 = traco-electronic:TME?*: DC/DC Converter TME Series 1 Watt Source: www.tracopower.com .. tme.pdf
X101 = con-ptr500:AK500/2: CONNECTOR
X401 = con-ptr500:AK500/3: CONNECTOR
X501 = con-cypressindustries:MINI-USB_SHIELD4P-: MINI USB 4 Pol. Source: www.cypressindustries.com; OC_FARNELL: unknown; OC_NEWARK: unknown